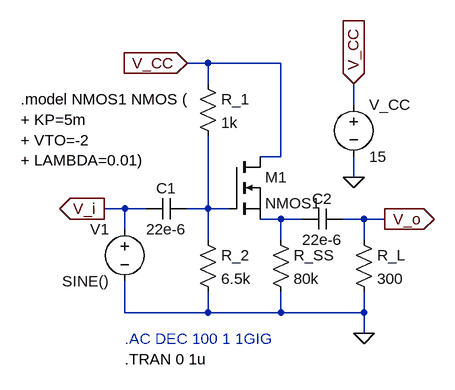
[diagram p0: schematic Test FET Amplifier.asc]
Test FET Amplifier.asc, the LTspice schematic file:
Version 4
SHEET 1 880 680
WIRE 208 144 176 144
WIRE 320 144 208 144
WIRE 208 176 208 144
WIRE 432 208 432 176
WIRE 320 288 320 144
WIRE 320 288 288 288
WIRE 432 320 432 288
WIRE 80 368 48 368
WIRE 112 368 80 368
WIRE 208 368 208 256
WIRE 208 368 176 368
WIRE 240 368 208 368
WIRE 320 384 288 384
WIRE 352 384 320 384
WIRE 448 384 416 384
WIRE 480 384 448 384
WIRE 80 400 80 368
WIRE 208 416 208 368
WIRE 320 416 320 384
WIRE 448 416 448 384
WIRE 80 528 80 480
WIRE 208 528 208 496
WIRE 208 528 80 528
WIRE 320 528 320 496
WIRE 320 528 208 528
WIRE 448 528 448 496
WIRE 448 528 320 528
WIRE 448 560 448 528
FLAG 480 384 V_o
IOPIN 480 384 Out
FLAG 432 176 V_CC
IOPIN 432 176 In
FLAG 432 320 0
FLAG 176 144 V_CC
IOPIN 176 144 In
FLAG 48 368 V_i
IOPIN 48 368 Out
FLAG 448 560 0
SYMBOL nmos 240 288 R0
SYMATTR InstName M1
SYMATTR Value NMOS1
SYMBOL Res 192 160 R0
SYMATTR InstName R_1
SYMATTR Value 1k
SYMBOL Res 304 400 R0
SYMATTR InstName R_SS
SYMATTR Value 80k
SYMBOL Res 192 400 R0
SYMATTR InstName R_2
SYMATTR Value 6.5k
SYMBOL Res 432 400 R0
SYMATTR InstName R_L
SYMATTR Value 300
SYMBOL Cap 176 352 R90
WINDOW 0 0 32 VBottom 2
WINDOW 3 32 32 VTop 2
SYMATTR InstName C1
SYMATTR Value 22e-6
SYMBOL Cap 416 368 R90
WINDOW 0 0 32 VBottom 2
WINDOW 3 32 32 VTop 2
SYMATTR InstName C2
SYMATTR Value 22e-6
SYMBOL Voltage 432 192 R0
SYMATTR InstName V_CC
SYMATTR Value 15
SYMBOL Voltage 80 384 M0
SYMATTR InstName V1
SYMATTR Value SINE()
SYMATTR Value2 AC 1
TEXT 80 568 Left 2 ;.AC DEC 100 1 1GIG
TEXT -80 200 Left 2 !.model NMOS1 NMOS (\n+ KP=5m\n+ VTO=-2\n+ LAMBDA=0.01)
TEXT 80 600 Left 2 !.TRAN 0 1u

The netlist it stands for:
* Test FET Amplifier.asc
M1 V_CC N001 N002 N002 NMOS1
R_1 V_CC N001 1k
R_SS N002 0 80k
R_2 N001 0 6.5k
R_L V_o 0 300
C1 N001 V_i 22e-6
C2 V_o N002 22e-6
V_CC V_CC 0 15
V1 V_i 0 SINE() AC 1
.model NMOS NMOS
.model PMOS PMOS
.lib standard.mos
* .AC DEC 100 1 1GIG
.model NMOS1 NMOS (
+ KP=5m
+ VTO=-2
+ LAMBDA=0.01)
.TRAN 0 1u
.backanno
.end